# EAGLE design IMU (EAGLE 9.6.2)
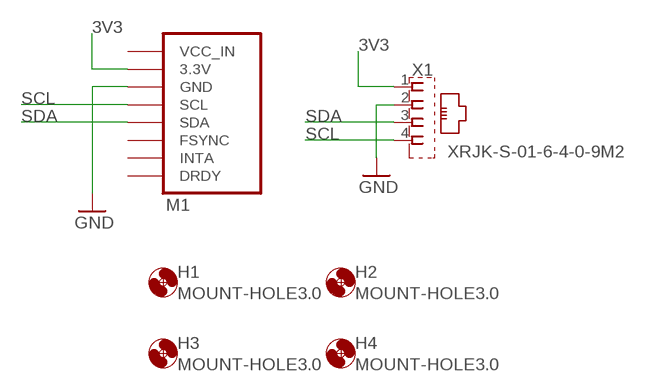
[diagram p0: schematic, sheet 1]

## Parts
H1  MOUNT-HOLE3.0  [3,0]
H2  MOUNT-HOLE3.0  [3,0]
H3  MOUNT-HOLE3.0  [3,0]
H4  MOUNT-HOLE3.0  [3,0]
M1  GY-87  [GY-87]
X1  XRJK-S-01-6-4-0-9M2  [XRJK-S-01-6-4-0-9M2]

## Nets
3V3: M1.2(3.3V) X1.1
GND: M1.3(GND) X1.2
SCL: M1.4(SCL) X1.4
SDA: M1.5(SDA) X1.3
Unconnected: M1.1(VCC_IN) M1.6(FSYNC) M1.7(INTA) M1.8(DRDY)

## Library data of the parts
H1-H4 = holes:MOUNT-HOLE: MOUNTING HOLE with drill center marker
M1 = pechera:GY-87: FEMALE HEADER; OC_FARNELL: unknown; OC_NEWARK: unknown
X1 = pechera:XRJK*4: RJ11 Connector without LED, 6 position, 4 contacts, thrue hole Source: XRJK-S-01-6-4-0-9M2(01).pdf

## Board
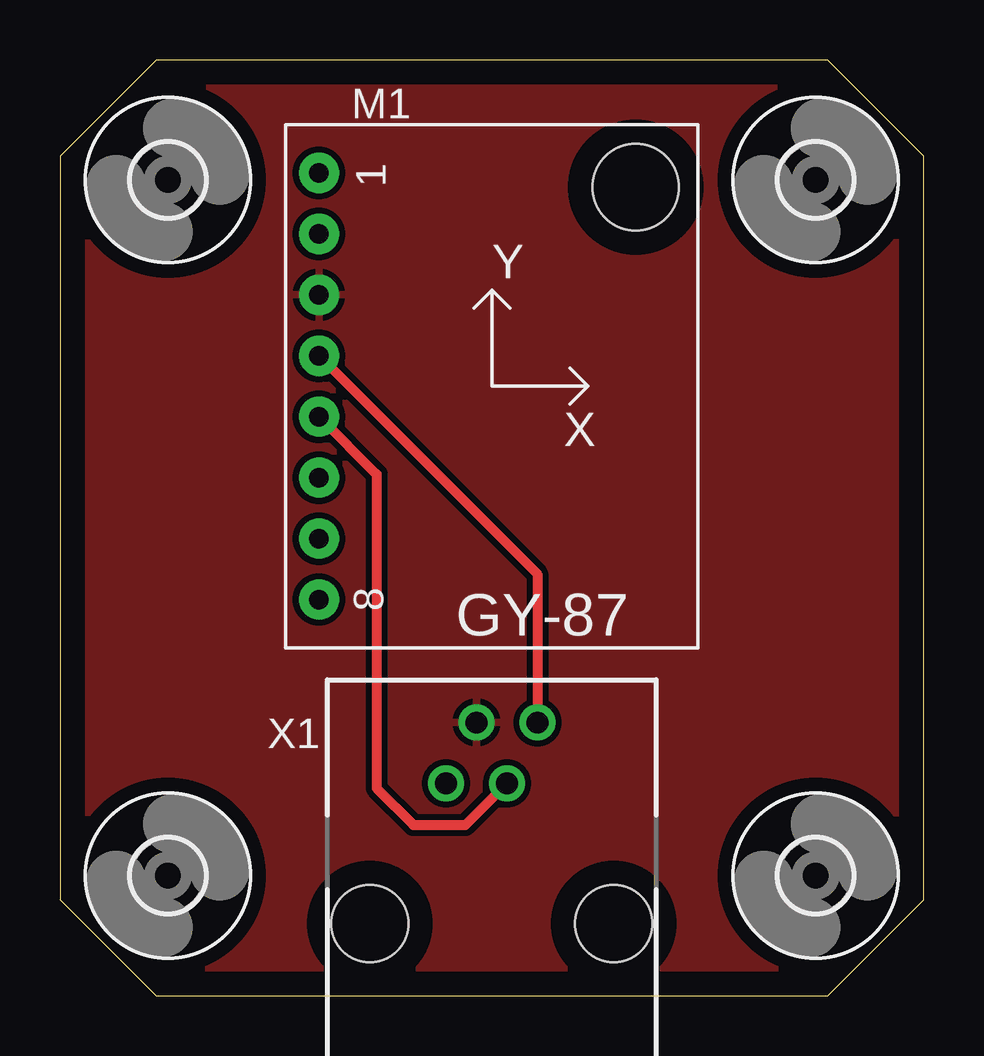
[diagram p1: board, top side]
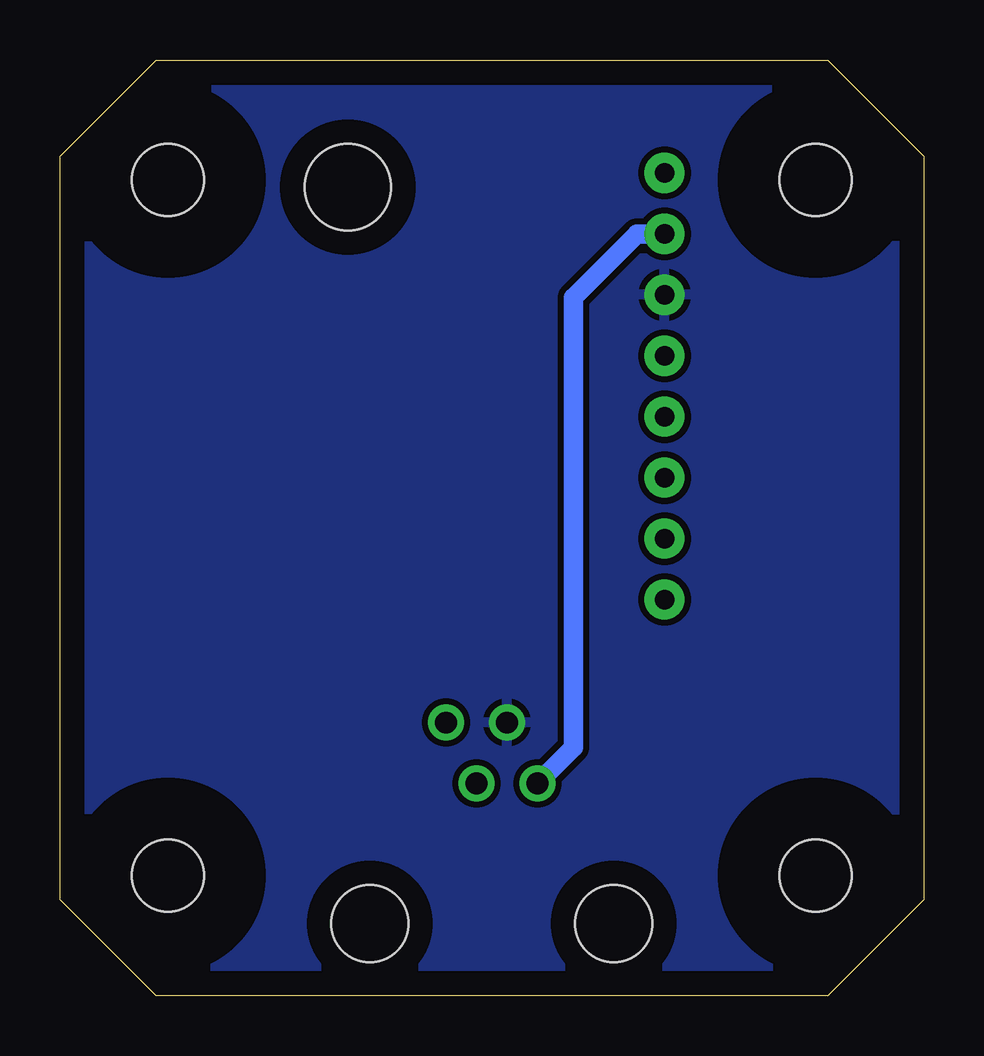
[diagram p2: board, bottom side, seen from below]

Size 36 x 39 mm. Coordinates in mm from the lower left corner, seen from the top.
Outline: 4,0 32,0 36,4 36,35 32,39 4,39 0,35 0,4 4,0
Copper layers (1*16): Top 0.035mm / dielectric 1.5mm / Bottom 0.035mm
Design rules "default *": minimum track width 6mil, minimum drill 0.35mm, track to track 10mil, track to pad 10mil, pad to pad 10mil, via to via 10mil, smd to smd 6mil, copper to edge 40mil, drill to drill 6mil, minimum pad ring 10mil, minimum via ring 8mil, stop-mask expansion 4mil, vias tented up to drill 0mil, thermal gap 10mil

### Footprints (pad centres in the part's own frame; a part is rotated, then mirrored left to right if it is on the bottom)
3,0 = hole 3: 0,0
GY-87 = drill 0.813 pad 1.676: 1 -7.2,8.89; 2 -7.2,6.35; 3 -7.2,3.81; 4 -7.2,1.27; 5 -7.2,-1.27; 6 -7.2,-3.81; 7 -7.2,-6.35; 8 -7.2,-8.89 | hole 3.6: 6,8.3
XRJK-S-01-6-4-0-9M2 = drill 0.9 pad 1.5: 1 -1.905,5.842; 2 -0.635,8.382; 3 0.635,5.842; 4 1.905,8.382 | hole 3.2: -5.08,0; 5.08,0

### Placement (x,y rotation side)
H1  4.5,5 0 top
H2  4.5,34 0 top
H3  31.5,5 0 top
H4  31.5,34 0 top
M1  18,25.4 0 top
X1  18,3 0 top

### Tracks (layer width: path | path; a pad name or v marks a point on that pad's centre or on a via)
3V3
  Bottom 0.813: M1.2 11.94,31.75 14.6,29.09 14.6,10.34 X1.1
GND
  pour Bottom: 0,0 0,39 36,39 36,0
  pour Top: 0,0 0,39 36,39 36,0
SCL
  Top 0.406: M1.4 19.91,17.57 X1.4
SDA
  Top 0.406: M1.5 13.21,21.72 13.21,8.64 14.73,7.11 16.91,7.11 X1.3

### Text on the board
tPlace: GY-87